# Altium schematic sheet Arquitetura_Geral.SchDoc
size 594 x 420 mm; SheetNumber: 1; SheetTotal: 3
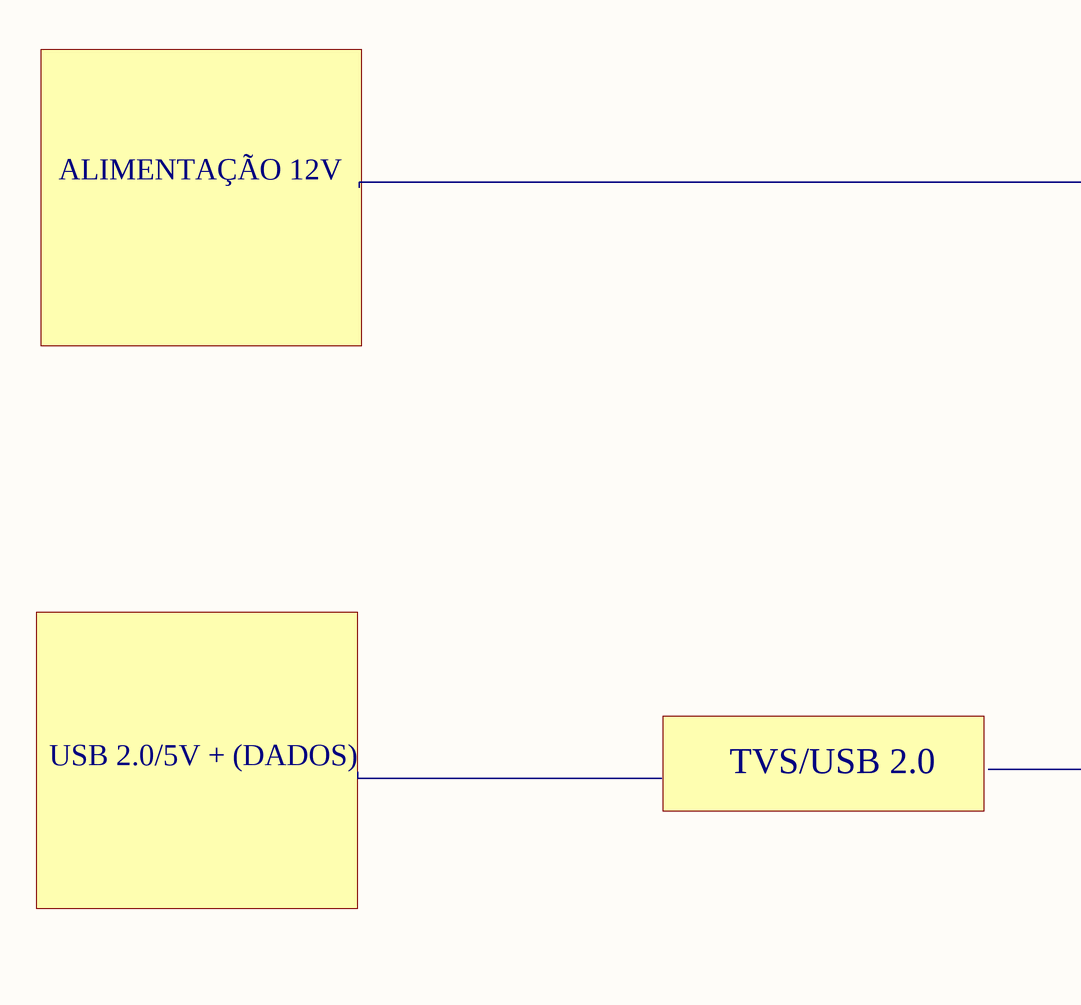
[diagram p0: Arquitetura_Geral.SchDoc, left]
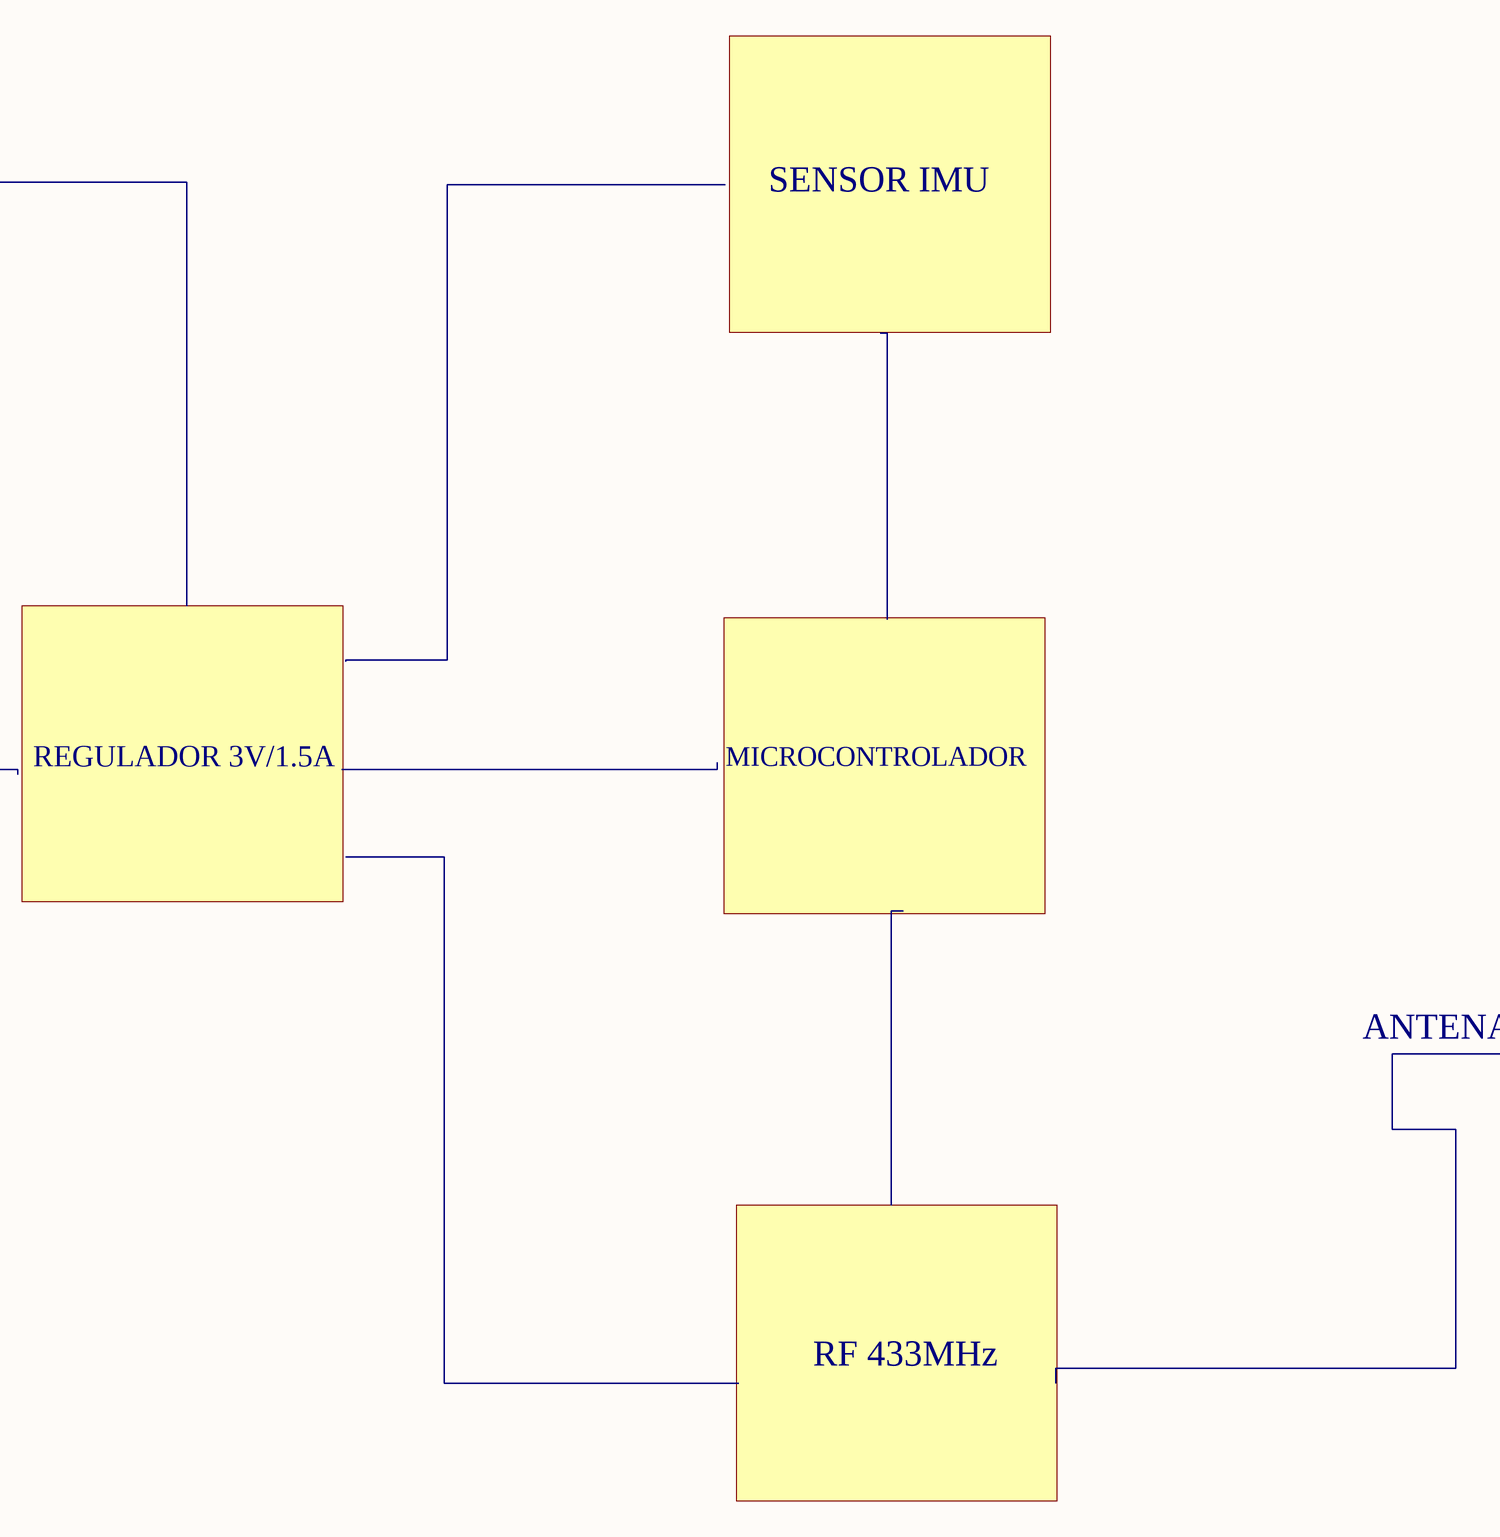
[diagram p1: Arquitetura_Geral.SchDoc, right]

## Notes on the sheet
- ALIMENTAÇÃO 12V
- SENSOR IMU
- USB 2.0/5V + (DADOS)
- TVS/USB 2.0
- REGULADOR 3V/1.5A
- MICROCONTROLADOR
- ANTENA
- RF 433MHz
- DWG NO:
- REV:
- THIS DOCUMENT AND THE DATA DISCLOSED HEREIN OR
- HEREWITH IS THE PROPERTY OF ALTIUM LIMITED AND MAY
- BE FREELY DISTRIBUTED IN WHOLE. NO RIGHTS ARE
- RESERVED OR EXPRESS OR IMPLIED WARANTEE GIVEN.
- REVISION
- DESCRIPTION
- DATE
- APPROVED
- ENG:
- APPROVALS
- PROJECT
- DSN:
- CHK:
- REFERENCE DOCUMENTS
- PROJECT REVISION:
- TITLE
- DOCUMENT REVISION:
- DESIGN ITEM:
- BOM:
- FAB DWG:
- PCB DWG:
- ASSY DWG:
- SCALE:
- A2
- SIZE
- CAGE CODE
- FILE NAME
- DWG NO.
- SHEET
- OF
- REV